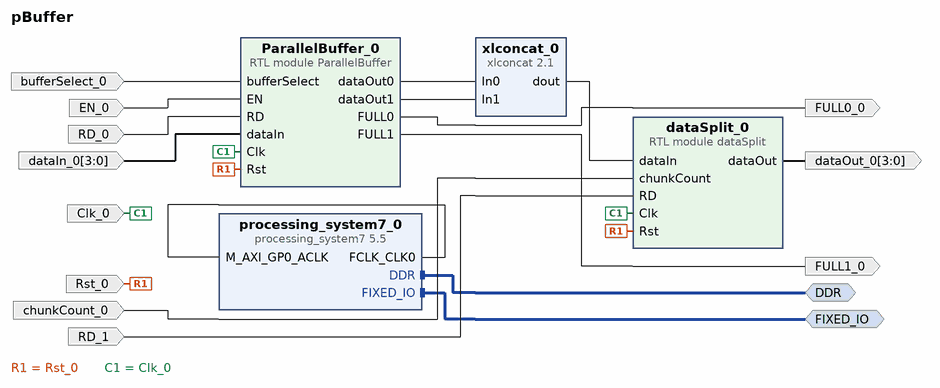
[diagram p0: block diagram of the top level]
# Vivado block design pBuffer, xc7z020clg400-1, Vivado 2019.2
create_bd_design pBuffer

create_bd_intf_port -mode Master -vlnv xilinx.com:interface:ddrx_rtl:1.0 DDR
create_bd_intf_port -mode Master -vlnv xilinx.com:display_processing_system7:fixedio_rtl:1.0 FIXED_IO
create_bd_port -dir I bufferSelect_0
create_bd_port -dir I EN_0
create_bd_port -dir I RD_0
create_bd_port -dir I -type rst Rst_0
create_bd_port -dir O FULL0_0
create_bd_port -dir O FULL1_0
create_bd_port -dir I -from 3 -to 0 dataIn_0
create_bd_port -dir I chunkCount_0
create_bd_port -dir I RD_1
create_bd_port -dir O -from 3 -to 0 dataOut_0
create_bd_port -dir I -type clk Clk_0

create_bd_cell -type module -reference ParallelBuffer ParallelBuffer_0
create_bd_cell -type module -reference dataSplit dataSplit_0
create_bd_cell -type ip -vlnv xilinx.com:ip:xlconcat:2.1 xlconcat_0
set_property -dict {CONFIG.IN0_WIDTH 4 CONFIG.IN1_WIDTH 4} [get_bd_cells xlconcat_0]
create_bd_cell -type ip -vlnv xilinx.com:ip:processing_system7:5.5 processing_system7_0
set_property -dict [list \
  CONFIG.PCW_APU_PERIPHERAL_FREQMHZ 650 \
  CONFIG.PCW_CRYSTAL_PERIPHERAL_FREQMHZ 50 \
  CONFIG.PCW_ENET0_ENET0_IO {MIO 16 .. 27} \
  CONFIG.PCW_ENET0_GRP_MDIO_ENABLE 1 \
  CONFIG.PCW_ENET0_GRP_MDIO_IO {MIO 52 .. 53} \
  CONFIG.PCW_ENET0_PERIPHERAL_ENABLE 1 \
  CONFIG.PCW_ENET0_RESET_ENABLE 1 \
  CONFIG.PCW_ENET0_RESET_IO {MIO 9} \
  CONFIG.PCW_ENET_RESET_ENABLE 1 \
  CONFIG.PCW_ENET_RESET_SELECT {Share reset pin} \
  CONFIG.PCW_FPGA0_PERIPHERAL_FREQMHZ 100 \
  CONFIG.PCW_FPGA1_PERIPHERAL_FREQMHZ 50 \
  CONFIG.PCW_GPIO_MIO_GPIO_ENABLE 1 \
  CONFIG.PCW_GPIO_MIO_GPIO_IO MIO \
  CONFIG.PCW_I2C_RESET_ENABLE 1 \
  CONFIG.PCW_M_AXI_GP0_FREQMHZ 10 \
  CONFIG.PCW_PERIPHERAL_BOARD_PRESET None \
  CONFIG.PCW_PRESET_BANK1_VOLTAGE {LVCMOS 1.8V} \
  CONFIG.PCW_QSPI_GRP_FBCLK_ENABLE 1 \
  CONFIG.PCW_QSPI_GRP_FBCLK_IO {MIO 8} \
  CONFIG.PCW_QSPI_GRP_SINGLE_SS_ENABLE 1 \
  CONFIG.PCW_QSPI_GRP_SINGLE_SS_IO {MIO 1 .. 6} \
  CONFIG.PCW_QSPI_PERIPHERAL_ENABLE 1 \
  CONFIG.PCW_QSPI_QSPI_IO {MIO 1 .. 6} \
  CONFIG.PCW_SD0_GRP_CD_ENABLE 1 \
  CONFIG.PCW_SD0_GRP_CD_IO {MIO 47} \
  CONFIG.PCW_SD0_GRP_WP_ENABLE 0 \
  CONFIG.PCW_SD0_PERIPHERAL_ENABLE 1 \
  CONFIG.PCW_SD0_SD0_IO {MIO 40 .. 45} \
  CONFIG.PCW_SDIO_PERIPHERAL_FREQMHZ 50 \
  CONFIG.PCW_SINGLE_QSPI_DATA_MODE x4 \
  CONFIG.PCW_UART0_PERIPHERAL_ENABLE 1 \
  CONFIG.PCW_UART0_UART0_IO {MIO 14 .. 15} \
  CONFIG.PCW_UART1_PERIPHERAL_ENABLE 0 \
  CONFIG.PCW_UART_PERIPHERAL_FREQMHZ 100 \
  CONFIG.PCW_UIPARAM_DDR_BUS_WIDTH {16 Bit} \
  CONFIG.PCW_UIPARAM_DDR_FREQ_MHZ 525 \
  CONFIG.PCW_UIPARAM_DDR_PARTNO {MT41J256M16 RE-125} \
  CONFIG.PCW_USB0_PERIPHERAL_ENABLE 1 \
  CONFIG.PCW_USB0_RESET_ENABLE 1 \
  CONFIG.PCW_USB0_RESET_IO {MIO 46} \
  CONFIG.PCW_USB0_USB0_IO {MIO 28 .. 39} \
  CONFIG.PCW_USB_RESET_ENABLE 1 \
  CONFIG.PCW_USB_RESET_SELECT {Share reset pin} \
] [get_bd_cells processing_system7_0]
# 481 more settings of processing_system7_0 are not shown: defaults, MIO pin electricals, DDR timing, and values the tool derives

# ---- connections ----

connect_bd_intf_net [get_bd_intf_ports DDR] [get_bd_intf_pins processing_system7_0/DDR]
connect_bd_intf_net [get_bd_intf_ports FIXED_IO] [get_bd_intf_pins processing_system7_0/FIXED_IO]
connect_bd_net -net bufferSelect_0_1 [get_bd_ports bufferSelect_0] [get_bd_pins ParallelBuffer_0/bufferSelect]
connect_bd_net -net EN_0_1 [get_bd_ports EN_0] [get_bd_pins ParallelBuffer_0/EN]
connect_bd_net -net RD_0_1 [get_bd_ports RD_0] [get_bd_pins ParallelBuffer_0/RD]
connect_bd_net [get_bd_pins ParallelBuffer_0/FULL0] [get_bd_ports FULL0_0]
connect_bd_net [get_bd_pins ParallelBuffer_0/FULL1] [get_bd_ports FULL1_0]
connect_bd_net -net dataIn_0_1 [get_bd_ports dataIn_0] [get_bd_pins ParallelBuffer_0/dataIn]
connect_bd_net [get_bd_pins ParallelBuffer_0/dataOut0] [get_bd_pins xlconcat_0/In0]
connect_bd_net [get_bd_pins ParallelBuffer_0/dataOut1] [get_bd_pins xlconcat_0/In1]
connect_bd_net [get_bd_pins xlconcat_0/dout] [get_bd_pins dataSplit_0/dataIn]
connect_bd_net -net chunkCount_0_1 [get_bd_ports chunkCount_0] [get_bd_pins dataSplit_0/chunkCount]
connect_bd_net -net RD_1_1 [get_bd_ports RD_1] [get_bd_pins dataSplit_0/RD]
connect_bd_net [get_bd_pins dataSplit_0/dataOut] [get_bd_ports dataOut_0]
connect_bd_net -net Rst_0_1 [get_bd_ports Rst_0] [get_bd_pins ParallelBuffer_0/Rst] [get_bd_pins dataSplit_0/Rst]
connect_bd_net [get_bd_pins processing_system7_0/FCLK_CLK0] [get_bd_pins processing_system7_0/M_AXI_GP0_ACLK]
connect_bd_net -net Clk_0_1 [get_bd_ports Clk_0] [get_bd_pins ParallelBuffer_0/Clk] [get_bd_pins dataSplit_0/Clk]

validate_bd_design
save_bd_design
